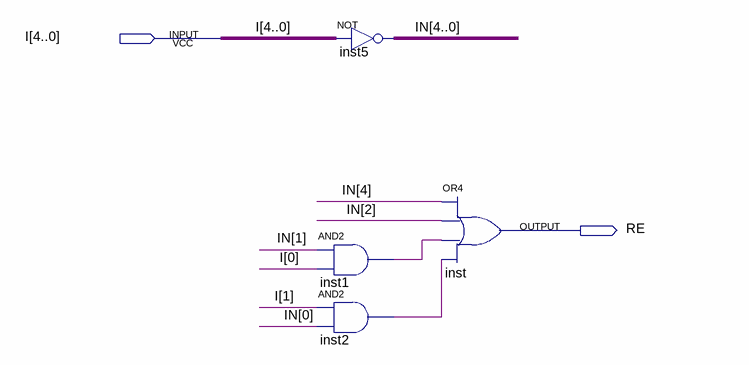
[diagram p0: schematic sheet]
// Quartus schematic RE.bdf as structural Verilog: 4 symbols, 2 pins
module RE (
  input  [4:0] I,
  output RE
);

  wire inst1_out, inst2_out;
  wire [4:0] IN;

  assign IN = ~I;  // NOT inst5, 5 bits wide
  and inst1 (inst1_out, IN[1], I[0]);
  and inst2 (inst2_out, I[1], IN[0]);
  or inst (RE, IN[4], IN[2], inst1_out, inst2_out);
endmodule
